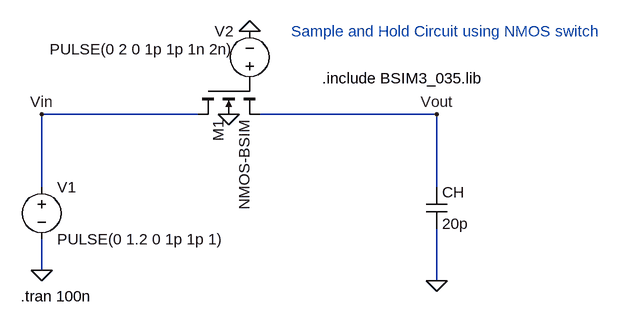
[diagram p0: schematic s_h_1.asc]
s_h_1.asc, the LTspice schematic file:
Version 4
SHEET 1 912 680
WIRE 48 160 -192 160
WIRE 416 160 144 160
WIRE -192 272 -192 160
WIRE 416 272 416 160
WIRE -192 400 -192 352
WIRE 416 416 416 336
FLAG -192 400 0
FLAG 416 416 0
FLAG -192 160 Vin
FLAG 416 160 Vout
FLAG 128 32 0
FLAG 96 160 0
SYMBOL voltage -192 256 R0
WINDOW 123 0 0 Left 0
WINDOW 39 0 0 Left 0
SYMATTR InstName V1
SYMATTR Value PULSE(0 1.2 0 1p 1p 1)
SYMBOL cap 400 272 R0
SYMATTR InstName CH
SYMATTR Value 20p
SYMBOL nmos4 48 112 M90
SYMATTR InstName M1
SYMATTR Value NMOS-BSIM
SYMATTR Value2 l=0.1u w=65u
SYMBOL voltage 128 128 R180
WINDOW 0 24 96 Left 2
WINDOW 3 24 68 Left 2
WINDOW 123 0 0 Left 0
WINDOW 39 0 0 Left 0
SYMATTR InstName V2
SYMATTR Value PULSE(0 2 0 1p 1p 1n 2n)
TEXT -224 440 Left 2 !.tran 100n
TEXT 240 104 Left 2 !.include BSIM3_035.lib
TEXT 192 32 Left 2 ;Sample and Hold Circuit using NMOS switch

The netlist it stands for:
* s_h_1.asc
V1 Vin 0 PULSE(0 1.2 0 1p 1p 1)
CH Vout 0 20p
M1 Vin P001 Vout 0 NMOS-BSIM l=0.1u w=65u
V2 P001 0 PULSE(0 2 0 1p 1p 1n 2n)
.model NMOS NMOS
.model PMOS PMOS
.lib standard.mos
.tran 100n
.include BSIM3_035.lib
* Sample and Hold Circuit using NMOS switch
.backanno
.end